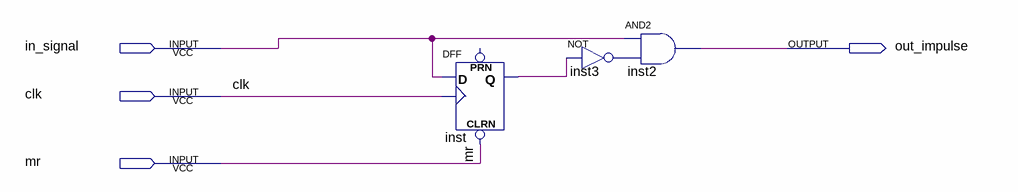
[diagram p0: schematic sheet]
// Quartus schematic signal_to_impulse.bdf as structural Verilog: 3 symbols, 4 pins
module signal_to_impulse (
  input  in_signal,
  input  clk,
  input  mr,
  output out_impulse
);

  wire inst3_out, inst_q;

  DFF inst (.CLRN(mr), .CLK(clk), .D(in_signal), .Q(inst_q));  // open: PRN
  not inst3 (inst3_out, inst_q);
  and inst2 (out_impulse, in_signal, inst3_out);
endmodule
